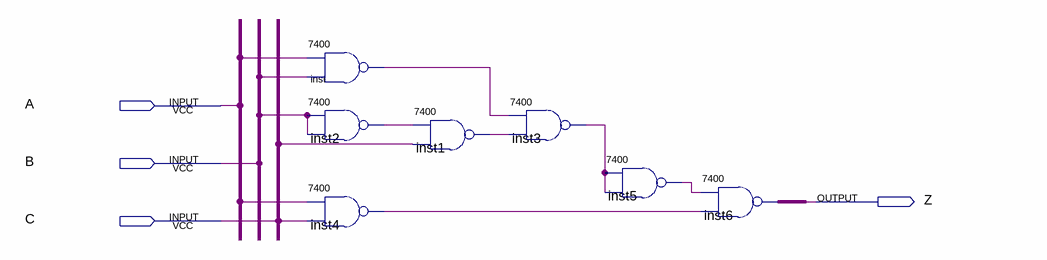
[diagram p0: schematic sheet]
// Quartus schematic Lab1_2.bdf as structural Verilog: 7 symbols, 4 pins
module Lab1_2 (
  input  A,
  input  B,
  input  C,
  output Z
);

  wire inst1_1, inst2_1, inst3_1, inst4_1, inst5_1, inst6_1, inst_1, undriven, undriven_2, undriven_3;

  \7400  inst (.\3 (undriven_3), .\2 (undriven_2), .\1 (inst_1));
  \7400  inst2 (.\3 (undriven_3), .\2 (undriven_3), .\1 (inst2_1));
  \7400  inst4 (.\3 (C), .\2 (undriven_2), .\1 (inst4_1));
  \7400  inst1 (.\3 (undriven), .\2 (inst2_1), .\1 (inst1_1));
  \7400  inst3 (.\3 (inst1_1), .\2 (inst_1), .\1 (inst3_1));
  \7400  inst5 (.\3 (inst3_1), .\2 (inst3_1), .\1 (inst5_1));
  \7400  inst6 (.\3 (inst4_1), .\2 (inst5_1), .\1 (inst6_1));
endmodule
